# Altium schematic sheet motors.SchDoc
size A
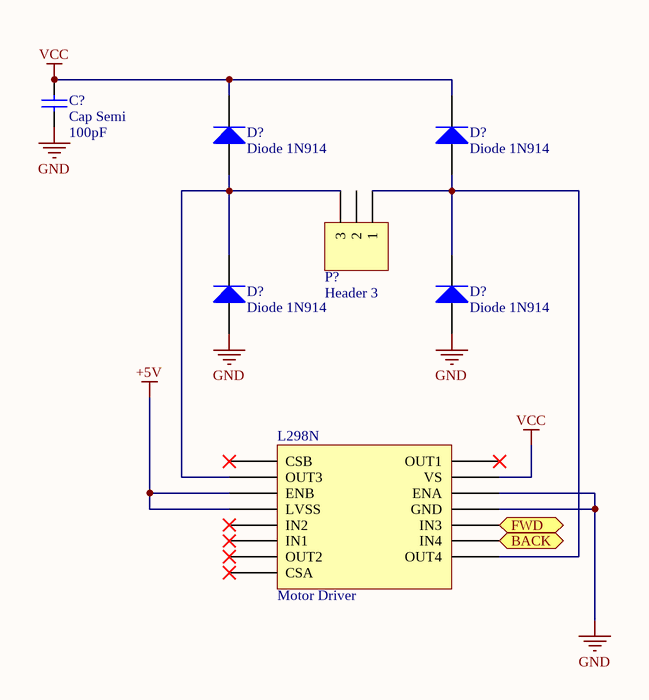
[diagram p0: motors.SchDoc]

## Parts
(Parts that share a designator on the sheet are numbered #1, #2 ... from top to bottom, then left to right.)
C?  Cap Semi  value 100pF  [C1206]
D?#1  Diode 1N914  [DO-35]
D?#2  Diode 1N914  [DO-35]
D?#3  Diode 1N914  [DO-35]
D?#4  Diode 1N914  [DO-35]
L298N  Motor Driver
P?  Header 3  [HDR1X3]

## Ports
BACK (in), FWD (in)

## Nets
+5V: L298N.ENB L298N.LVSS
GND: C?.1 D?#3.1(A) D?#4.1(A) L298N.ENA L298N.GND
VCC: C?.2 D?#1.2(K) D?#2.2(K) L298N.VS
BACK: L298N.IN4 ; port BACK
FWD: L298N.IN3 ; port FWD
NetD?#1_1: D?#1.1(A) D?#3.2(K) L298N.OUT3 P?.3
NetD?#2_1: D?#2.1(A) D?#4.2(K) L298N.OUT4 P?.1

Not connected (* = marked no-connect by the designer): L298N CSA* CSB* IN1* IN2* OUT1* OUT2*; P? 2

## Library data of the parts
C? = Cap Semi: Capacitor (Semiconductor SIM Model); Published: 8-Jun-2000; LatestRevisionDate: 29-May-2009; LatestRevisionNote: IPC-7351 Footprint Added.; PackageReference: C1206; Publisher: Altium Limited; PackageDescription: Chip Capacitor
D?#1-D?#4 = Diode 1N914: High Conductance Fast Diode; Published: 8-Jun-2000; LatestRevisionDate: 17-Jul-2002; LatestRevisionNote: Re-released for DXP Platform.; DatasheetVersion: 1997; PackageReference: DO-35; Publisher: Altium Limited; PackageDescription: Diode, Axial; Body 3.8 x 1.9 mm (LxDia. max), Lead Dia. 0.53 mm (max); Code_JEDEC: DO-204-AH; ComponentLink1Description: Manufacturer Link; ComponentLink1URL: http://www.fairchildsemi.com/; ComponentLink2Description: Datasheet; ComponentLink2URL: http://www.fairchildsemi.com/ds/1N%2F1N4448.pdf
L298N = L298N: Dual Full Bridge Motor Driver; ComponentLink: http://www.sparkfun.com/datasheets/Components/General/L298N.pdf
P? = Header 3: Header, 3-Pin; LatestRevisionDate: 17-Jul-2002; LatestRevisionNote: Re-released for DXP Platform.; Publisher: Altium Limited